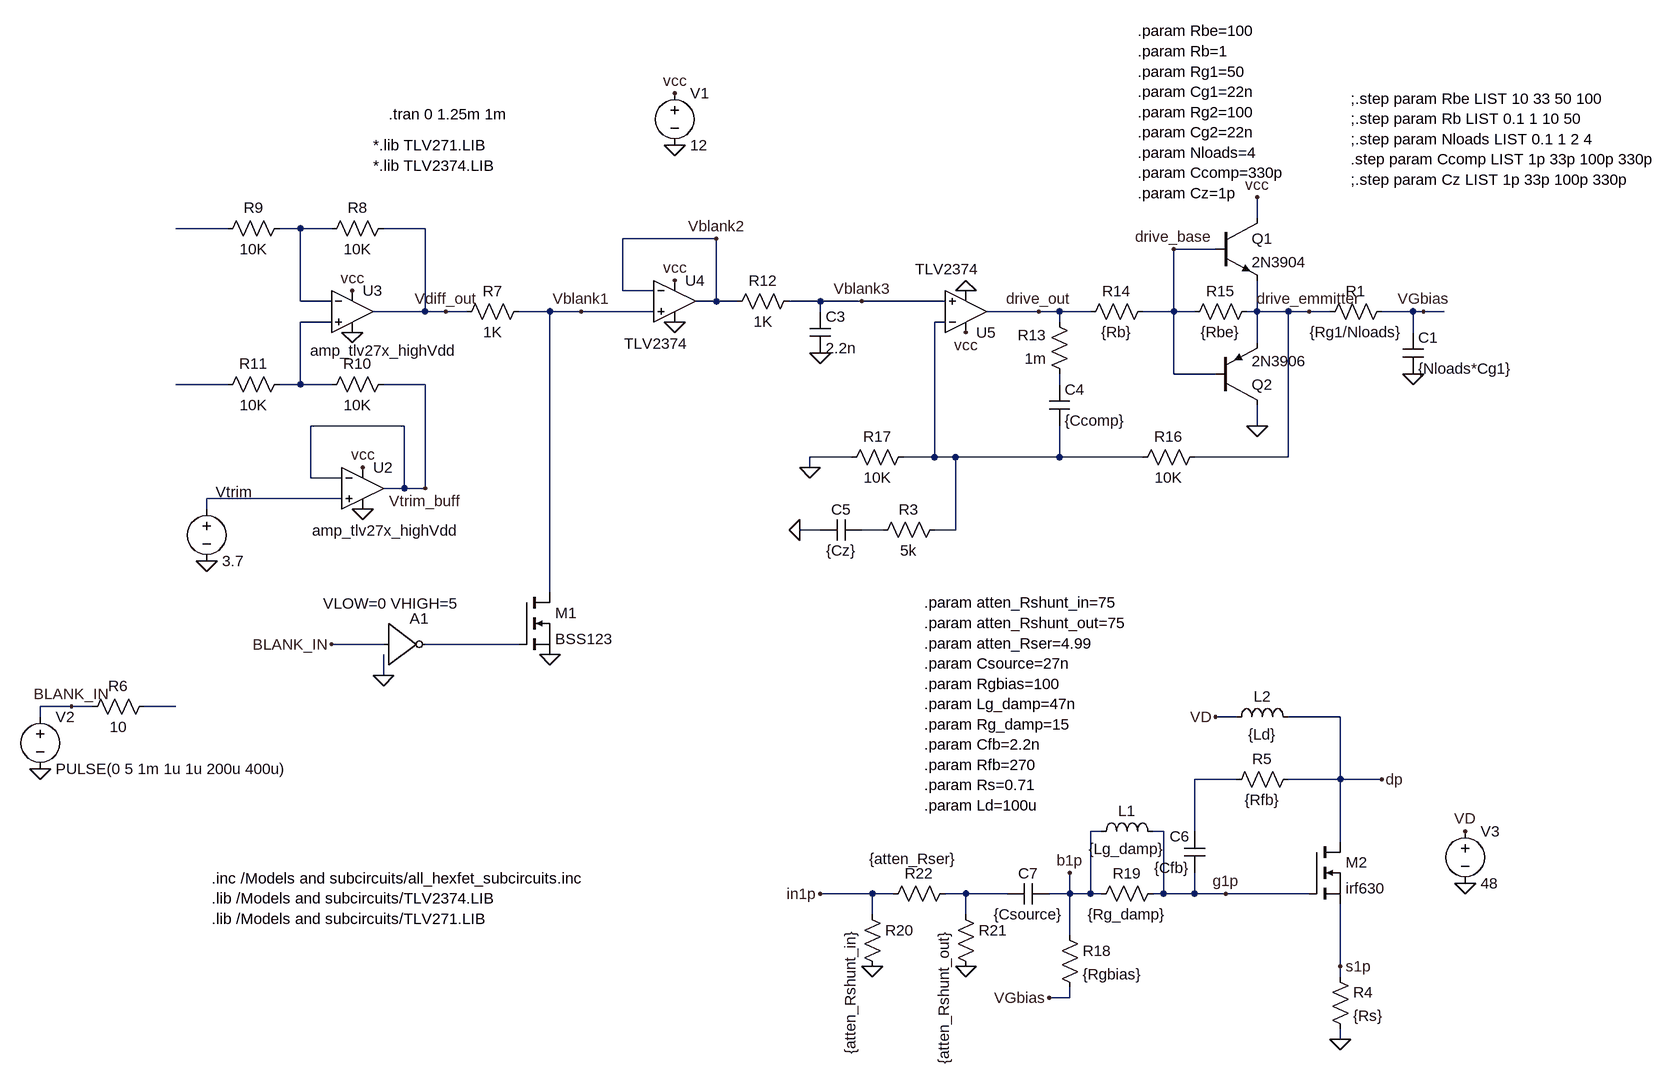
[diagram p0: schematic bias_controller_tlv27x_04_03_22.asc]
bias_controller_tlv27x_04_03_22.asc, the LTspice schematic file:
Version 4
SHEET 1 1512 680
WIRE 864 -960 864 -992
WIRE -720 -944 -800 -944
WIRE -608 -944 -640 -944
WIRE -560 -944 -608 -944
WIRE -416 -944 -480 -944
WIRE 32 -928 -112 -928
WIRE 800 -912 736 -912
WIRE -112 -848 -112 -928
WIRE -64 -848 -112 -848
WIRE -608 -832 -608 -944
WIRE -560 -832 -608 -832
WIRE 32 -832 32 -928
WIRE 32 -832 0 -832
WIRE 64 -832 32 -832
WIRE 192 -832 144 -832
WIRE 256 -832 192 -832
WIRE 384 -832 256 -832
WIRE -416 -816 -416 -944
WIRE -416 -816 -496 -816
WIRE -384 -816 -416 -816
WIRE -352 -816 -384 -816
WIRE -224 -816 -272 -816
WIRE -176 -816 -224 -816
WIRE -64 -816 -176 -816
WIRE 192 -816 192 -832
WIRE 528 -816 448 -816
WIRE 560 -816 528 -816
WIRE 608 -816 560 -816
WIRE 736 -816 736 -912
WIRE 736 -816 688 -816
WIRE 768 -816 736 -816
WIRE 864 -816 864 -864
WIRE 864 -816 848 -816
WIRE 912 -816 864 -816
WIRE 944 -816 912 -816
WIRE 976 -816 944 -816
WIRE 1104 -816 1056 -816
WIRE 1120 -816 1104 -816
WIRE 1152 -816 1120 -816
WIRE -560 -800 -608 -800
WIRE 384 -800 368 -800
WIRE 560 -800 560 -816
WIRE 1104 -784 1104 -816
WIRE 864 -768 864 -816
WIRE 736 -720 736 -816
WIRE 800 -720 736 -720
WIRE -720 -704 -800 -704
WIRE -608 -704 -608 -800
WIRE -608 -704 -640 -704
WIRE -560 -704 -608 -704
WIRE -416 -704 -480 -704
WIRE 560 -704 560 -720
WIRE -448 -640 -592 -640
WIRE 864 -640 864 -672
WIRE 240 -592 176 -592
WIRE 368 -592 368 -800
WIRE 368 -592 320 -592
WIRE 400 -592 368 -592
WIRE 560 -592 560 -640
WIRE 560 -592 400 -592
WIRE 688 -592 560 -592
WIRE 912 -592 912 -816
WIRE 912 -592 768 -592
WIRE 176 -576 176 -592
WIRE -592 -560 -592 -640
WIRE -544 -560 -592 -560
WIRE -448 -544 -448 -640
WIRE -448 -544 -480 -544
WIRE -416 -544 -416 -704
WIRE -416 -544 -448 -544
WIRE -544 -528 -752 -528
WIRE -752 -512 -752 -528
WIRE 192 -480 160 -480
WIRE 288 -480 256 -480
WIRE 400 -480 400 -592
WIRE 400 -480 368 -480
WIRE -224 -384 -224 -816
WIRE -480 -304 -560 -304
WIRE -272 -304 -416 -304
WIRE -480 -256 -480 -288
WIRE -960 -208 -1008 -208
WIRE -928 -208 -960 -208
WIRE -800 -208 -848 -208
WIRE -1008 -192 -1008 -208
WIRE 832 -192 800 -192
WIRE 992 -192 912 -192
WIRE 832 -96 768 -96
WIRE 992 -96 992 -192
WIRE 992 -96 912 -96
WIRE 1056 -96 992 -96
WIRE 624 -16 608 -16
WIRE 720 -16 704 -16
WIRE 768 -16 768 -96
WIRE 992 0 992 -96
WIRE 272 80 192 80
WIRE 304 80 272 80
WIRE 416 80 384 80
WIRE 480 80 416 80
WIRE 576 80 576 48
WIRE 576 80 544 80
WIRE 608 80 608 -16
WIRE 608 80 576 80
WIRE 624 80 608 80
WIRE 720 80 720 -16
WIRE 720 80 704 80
WIRE 768 80 768 48
WIRE 768 80 720 80
WIRE 816 80 768 80
WIRE 944 80 816 80
WIRE 272 112 272 80
WIRE 416 112 416 80
WIRE 576 144 576 80
WIRE 992 192 992 96
WIRE 992 208 992 192
WIRE 576 240 576 224
WIRE 576 240 544 240
WIRE 992 304 992 288
FLAG -1008 -112 0
FLAG -480 -256 0
FLAG -560 -304 BLANK_IN
FLAG -960 -208 BLANK_IN
FLAG -224 -288 0
FLAG -512 -576 vcc
FLAG -512 -512 0
FLAG -752 -432 0
FLAG -528 -848 vcc
FLAG -528 -784 0
FLAG -32 -864 vcc
FLAG -32 -800 0
FLAG 416 -784 vcc
FLAG 416 -848 0
FLAG 192 -752 0
FLAG 864 -640 0
FLAG 864 -992 vcc
FLAG 176 -576 0
FLAG -32 -1072 0
FLAG -32 -1152 vcc
FLAG 1104 -720 0
FLAG -416 -544 Vtrim_buff
FLAG -384 -816 Vdiff_out
FLAG -176 -816 Vblank1
FLAG 32 -928 Vblank2
FLAG 256 -832 Vblank3
FLAG 528 -816 drive_out
FLAG 736 -912 drive_base
FLAG 944 -816 drive_emmitter
FLAG 1120 -816 VGbias
FLAG 160 -480 0
FLAG 992 304 0
FLAG 1056 -96 dp
FLAG 816 80 g1p
FLAG 992 192 s1p
FLAG 192 80 in1p
FLAG 576 48 b1p
FLAG 800 -192 VD
FLAG 544 240 VGbias
FLAG 416 192 0
FLAG 272 192 0
FLAG 1184 64 0
FLAG 1184 -16 VD
SYMBOL nmos -272 -384 R0
SYMATTR InstName M1
SYMATTR Value BSS123
SYMBOL voltage -1008 -208 R0
WINDOW 123 0 0 Left 0
WINDOW 39 0 0 Left 0
SYMATTR InstName V2
SYMATTR Value PULSE(0 5 1m 1u 1u 200u 400u)
SYMBOL res -832 -224 R90
WINDOW 0 0 56 VBottom 2
WINDOW 3 32 56 VTop 2
SYMATTR InstName R6
SYMATTR Value 10
SYMBOL Digital\\inv -480 -368 R0
WINDOW 3 -93 1 Left 2
SYMATTR Value VLOW=0 VHIGH=5
SYMATTR InstName A1
SYMBOL voltage -752 -528 R0
WINDOW 123 0 0 Left 0
WINDOW 39 0 0 Left 0
WINDOW 0 14 -10 Left 2
SYMATTR InstName Vtrim
SYMATTR Value 3.7
SYMBOL Opamps\\opamp2 -512 -608 R0
WINDOW 3 -78 129 Left 2
SYMATTR InstName U2
SYMATTR Value amp_tlv27x_highVdd
SYMBOL Opamps\\opamp2 -528 -880 R0
WINDOW 3 -65 124 Left 2
SYMATTR InstName U3
SYMATTR Value amp_tlv27x_highVdd
SYMBOL res -464 -960 R90
WINDOW 0 0 56 VBottom 2
WINDOW 3 32 56 VTop 2
SYMATTR InstName R8
SYMATTR Value 10K
SYMBOL res -624 -960 R90
WINDOW 0 0 56 VBottom 2
WINDOW 3 32 56 VTop 2
SYMATTR InstName R9
SYMATTR Value 10K
SYMBOL res -464 -720 R90
WINDOW 0 0 56 VBottom 2
WINDOW 3 32 56 VTop 2
SYMATTR InstName R10
SYMATTR Value 10K
SYMBOL res -624 -720 R90
WINDOW 0 0 56 VBottom 2
WINDOW 3 32 56 VTop 2
SYMATTR InstName R11
SYMATTR Value 10K
SYMBOL res -256 -832 R90
WINDOW 0 0 56 VBottom 2
WINDOW 3 32 56 VTop 2
SYMATTR InstName R7
SYMATTR Value 1K
SYMBOL Opamps\\opamp2 -32 -896 R0
WINDOW 3 -78 129 Left 2
SYMATTR InstName U4
SYMATTR Value TLV2374
SYMBOL res 160 -848 R90
WINDOW 0 0 56 VBottom 2
WINDOW 3 32 56 VTop 2
SYMATTR InstName R12
SYMATTR Value 1K
SYMBOL cap 176 -816 R0
SYMATTR InstName C3
SYMATTR Value 2.2n
SYMBOL res 576 -704 R180
WINDOW 0 36 76 Left 2
WINDOW 3 36 40 Left 2
SYMATTR InstName R13
SYMATTR Value 1m
SYMBOL cap 544 -704 R0
SYMATTR InstName C4
SYMATTR Value {Ccomp}
SYMBOL res 592 -800 R270
WINDOW 0 32 56 VTop 2
WINDOW 3 0 56 VBottom 2
SYMATTR InstName R14
SYMATTR Value {Rb}
SYMBOL npn 800 -960 R0
SYMATTR InstName Q1
SYMATTR Value 2N3904
SYMBOL pnp 800 -672 M180
SYMATTR InstName Q2
SYMATTR Value 2N3906
SYMBOL res 752 -800 R270
WINDOW 0 32 56 VTop 2
WINDOW 3 0 56 VBottom 2
SYMATTR InstName R15
SYMATTR Value {Rbe}
SYMBOL res 784 -608 R90
WINDOW 0 0 56 VBottom 2
WINDOW 3 32 56 VTop 2
SYMATTR InstName R16
SYMATTR Value 10K
SYMBOL res 336 -608 R90
WINDOW 0 0 56 VBottom 2
WINDOW 3 32 56 VTop 2
SYMATTR InstName R17
SYMATTR Value 10K
SYMBOL voltage -32 -1168 R0
WINDOW 123 0 0 Left 0
WINDOW 39 0 0 Left 0
SYMATTR InstName V1
SYMATTR Value 12
SYMBOL res 960 -800 R270
WINDOW 0 32 56 VTop 2
WINDOW 3 0 56 VBottom 2
SYMATTR InstName R1
SYMATTR Value {Rg1/Nloads}
SYMBOL cap 1088 -784 R0
SYMATTR InstName C1
SYMATTR Value {Nloads*Cg1}
SYMBOL Opamps\\opamp2 416 -752 M180
WINDOW 3 -78 129 Left 2
SYMATTR InstName U5
SYMATTR Value TLV2374
SYMBOL res 384 -496 R90
WINDOW 0 0 56 VBottom 2
WINDOW 3 32 56 VTop 2
SYMATTR InstName R3
SYMATTR Value 5k
SYMBOL cap 256 -496 R90
WINDOW 0 0 32 VBottom 2
WINDOW 3 32 32 VTop 2
SYMATTR InstName C5
SYMATTR Value {Cz}
SYMBOL res 976 192 R0
SYMATTR InstName R4
SYMATTR Value {Rs}
SYMBOL res 928 -112 R90
WINDOW 0 0 56 VBottom 2
WINDOW 3 32 56 VTop 2
SYMATTR InstName R5
SYMATTR Value {Rfb}
SYMBOL cap 784 48 R180
WINDOW 0 24 56 Left 2
WINDOW 3 24 8 Left 2
SYMATTR InstName C6
SYMATTR Value {Cfb}
SYMBOL res 560 128 R0
SYMATTR InstName R18
SYMATTR Value {Rgbias}
SYMBOL res 720 64 R90
WINDOW 0 0 56 VBottom 2
WINDOW 3 32 56 VTop 2
SYMATTR InstName R19
SYMATTR Value {Rg_damp}
SYMBOL ind 608 0 R270
WINDOW 0 32 56 VTop 2
WINDOW 3 5 56 VBottom 2
SYMATTR InstName L1
SYMATTR Value {Lg_damp}
SYMBOL cap 544 64 R90
WINDOW 0 0 32 VBottom 2
WINDOW 3 32 32 VTop 2
SYMATTR InstName C7
SYMATTR Value {Csource}
SYMBOL ind 816 -176 R270
WINDOW 0 32 56 VTop 2
WINDOW 3 5 56 VBottom 2
SYMATTR InstName L2
SYMATTR Value {Ld}
SYMBOL nmos 944 0 R0
SYMATTR InstName M2
SYMATTR Value irf630
SYMATTR Prefix X
SYMBOL res 256 96 R0
WINDOW 3 -18 39 VRight 2
SYMATTR Value {atten_Rshunt_in}
SYMATTR InstName R20
SYMBOL res 400 96 R0
WINDOW 3 -18 39 VRight 2
SYMATTR Value {atten_Rshunt_out}
SYMATTR InstName R21
SYMBOL res 400 64 R90
WINDOW 0 0 56 VBottom 2
WINDOW 3 -53 65 VTop 2
SYMATTR InstName R22
SYMATTR Value {atten_Rser}
SYMBOL voltage 1184 -32 R0
WINDOW 123 0 0 Left 0
WINDOW 39 0 0 Left 0
SYMATTR InstName V3
SYMATTR Value 48
TEXT -472 -1120 Left 2 !.tran 0 1.25m 1m
TEXT -496 -1072 Left 2 !*.lib TLV271.LIB\n*.lib TLV2374.LIB
TEXT 680 -1248 Left 2 !.param Rbe=100\n.param Rb=1\n.param Rg1=50\n.param Cg1=22n\n.param Rg2=100\n.param Cg2=22n\n.param Nloads=4\n.param Ccomp=330p\n.param Cz=1p
TEXT 1008 -1144 Left 2 !;.step param Rbe LIST 10 33 50 100\n;.step param Rb LIST 0.1 1 10 50\n;.step param Nloads LIST 0.1 1 2 4\n.step param Ccomp LIST 1p 33p 100p 330p\n;.step param Cz LIST 1p 33p 100p 330p
TEXT 352 -368 Left 2 !.param atten_Rshunt_in=75\n.param atten_Rshunt_out=75\n.param atten_Rser=4.99\n.param Csource=27n\n.param Rgbias=100\n.param Lg_damp=47n\n.param Rg_damp=15\n.param Cfb=2.2n\n.param Rfb=270\n.param Rs=0.71\n.param Ld=100u
TEXT -744 56 Left 2 !.inc /Models and subcircuits/all_hexfet_subcircuits.inc\n.lib /Models and subcircuits/TLV2374.LIB\n.lib /Models and subcircuits/TLV271.LIB

The netlist it stands for:
* bias_controller_tlv27x_04_03_22.asc
M1 Vblank1 N009 0 0 BSS123
V2 BLANK_IN 0 PULSE(0 5 1m 1u 1u 200u 400u)
R6 N010 BLANK_IN 10
A1 BLANK_IN 0 0 0 0 N009 0 0 BUF VLOW=0 VHIGH=5
Vtrim N007 0 3.7
XU2 N007 Vtrim_buff vcc 0 Vtrim_buff amp_tlv27x_highVdd  ; pins In+ In- V+ V- OUT
XU3 N003 N002 vcc 0 Vdiff_out amp_tlv27x_highVdd  ; pins In+ In- V+ V- OUT
R8 Vdiff_out N002 10K
R9 N002 N001 10K
R10 Vtrim_buff N003 10K
R11 N003 N005 10K
R7 Vblank1 Vdiff_out 1K
XU4 Vblank1 Vblank2 vcc 0 Vblank2 TLV2374  ; pins In+ In- V+ V- OUT
R12 Vblank3 Vblank2 1K
C3 Vblank3 0 2.2n
R13 N006 drive_out 1m
C4 N006 N004 {Ccomp}
R14 drive_out drive_base {Rb}
Q1 vcc drive_base drive_emmitter 0 2N3904
Q2 0 drive_base drive_emmitter 0 2N3906
R15 drive_base drive_emmitter {Rbe}
R16 drive_emmitter N004 10K
R17 N004 0 10K
V1 vcc 0 12
R1 drive_emmitter VGbias {Rg1/Nloads}
C1 VGbias 0 {Nloads*Cg1}
XU5 Vblank3 N004 vcc 0 drive_out TLV2374  ; pins In+ In- V+ V- OUT
R3 N004 N008 5k
C5 N008 0 {Cz}
R4 s1p 0 {Rs}
R5 dp N011 {Rfb}
C6 g1p N011 {Cfb}
R18 b1p VGbias {Rgbias}
R19 g1p b1p {Rg_damp}
L1 b1p g1p {Lg_damp}
C7 b1p N012 {Csource}
L2 VD dp {Ld}
XM2 dp g1p s1p irf630  ; pins D G S
R20 in1p 0 {atten_Rshunt_in}
R21 N012 0 {atten_Rshunt_out}
R22 N012 in1p {atten_Rser}
V3 VD 0 48
.model NPN NPN
.model PNP PNP
.lib standard.bjt
.model NMOS NMOS
.model PMOS PMOS
.lib standard.mos
.tran 0 1.25m 1m
*.lib TLV271.LIB
*.lib TLV2374.LIB
.param Rbe=100
.param Rb=1
.param Rg1=50
.param Cg1=22n
.param Rg2=100
.param Cg2=22n
.param Nloads=4
.param Ccomp=330p
.param Cz=1p
;.step param Rbe LIST 10 33 50 100
;.step param Rb LIST 0.1 1 10 50
;.step param Nloads LIST 0.1 1 2 4
.step param Ccomp LIST 1p 33p 100p 330p
;.step param Cz LIST 1p 33p 100p 330p
.param atten_Rshunt_in=75
.param atten_Rshunt_out=75
.param atten_Rser=4.99
.param Csource=27n
.param Rgbias=100
.param Lg_damp=47n
.param Rg_damp=15
.param Cfb=2.2n
.param Rfb=270
.param Rs=0.71
.param Ld=100u
.inc /Models and subcircuits/all_hexfet_subcircuits.inc
.lib /Models and subcircuits/TLV2374.LIB
.lib /Models and subcircuits/TLV271.LIB
.backanno
.end